# Altium schematic sheet FemaleHeader.SchDoc
size A
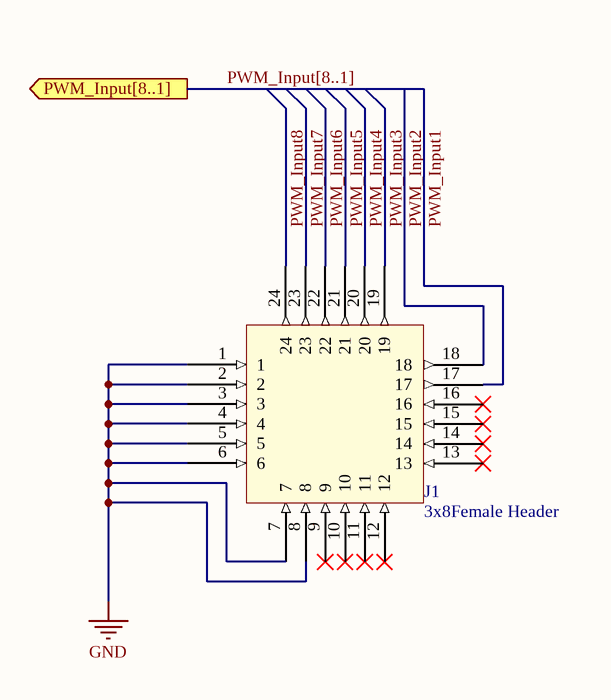
[diagram p0: FemaleHeader.SchDoc]

## Parts
J1  3x8Female Header  [3x8 Female Header]

## Ports
PWM_Input[8..1] (out)

## Nets
GND: J1.1 J1.2 J1.3 J1.4 J1.5 J1.6 J1.7 J1.8
PWM_Input1: J1.17
PWM_Input2: J1.18
PWM_Input3: J1.19
PWM_Input4: J1.20
PWM_Input5: J1.21
PWM_Input6: J1.22
PWM_Input7: J1.23
PWM_Input8: J1.24

Not connected (* = marked no-connect by the designer): J1 9* 10* 11* 12* 13* 14* 15* 16*

## Buses and harness runs
bus PWM_Input[8..1] = port PWM_Input[8..1]

## Library data of the parts
J1 = 3x8 Female Header: Manufacturer: URC; Manufacturer Part Number: Custom